# EAGLE schematic H-bro_gear (EAGLE 6.5.0)
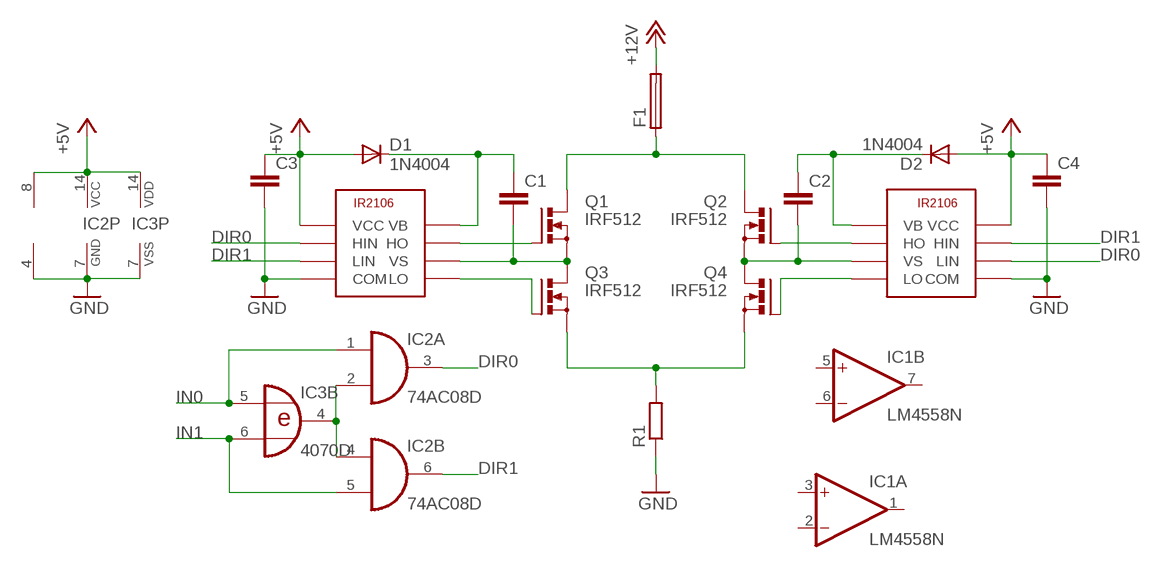
[diagram p0: schematic, sheet 1]

## Parts
C1  C-EU025-025X050  [C025-025X050]
C2  C-EU025-025X050  [C025-025X050]
C3  C-EU025-025X050  [C025-025X050]
C4  C-EU025-025X050  [C025-025X050]
D1  1N4004  [DO41-10]
D2  1N4004  [DO41-10]
F1  PICOFUSE  [PICOFUSE]
IC1  LM4558N  [DIL08]
IC2  74AC08D  [SO14]
IC3  4070D  [SO14]
Q1  IRF512  [TO220BV]
Q2  IRF512  [TO220BV]
Q3  IRF512  [TO220BV]
Q4  IRF512  [TO220BV]
R1  R-EU_0309/12  [0309/12]
U$1  IR2106  [IR2106]
U$2  IR2106  [IR2106]

## Nets
+5V: C3.1 C4.1 D1.A D2.A IC1.8(P:V+) IC2.14(P:VCC) IC3.14(P:VDD) U$1.VCC U$2.VCC
+12V: F1.2
DIR0: IC2.3(A:O) U$1.HIN U$2.LIN
DIR1: IC2.6(B:O) U$1.LIN U$2.HIN
GND: C3.2 C4.2 IC1.4(P:V-) IC2.7(P:GND) IC3.7(P:VSS) R1.1 U$1.COM U$2.COM
IN0: IC2.1(A:I0) IC3.5(B:I0)
IN1: IC2.5(B:I1) IC3.6(B:I1)
N$1: Q1.G U$1.HO
N$2: Q3.G U$1.LO
N$3: Q2.G U$2.HO
N$4: Q4.G U$2.LO
N$6: C1.2 Q1.S Q3.D U$1.VS
N$7: C2.2 Q2.S Q4.D U$2.VS
N$9: F1.1 Q1.D Q2.D
N$10: C1.1 D1.C U$1.VB
N$11: Q3.S Q4.S R1.2
N$13: C2.1 D2.C U$2.VB
N$15: IC2.2(A:I1) IC2.4(B:I0) IC3.4(B:O)
Unconnected: IC1.1(A:OUT) IC1.2(A:-IN) IC1.3(A:+IN) IC1.5(B:+IN) IC1.6(B:-IN) IC1.7(B:OUT) IC2.8(C:O) IC2.9(C:I0) IC2.10(C:I1) IC2.11(D:O) IC2.12(D:I0) IC2.13(D:I1) IC3.1(A:I0) IC3.2(A:I1) IC3.3(A:O) IC3.8(C:I0) IC3.9(C:I1) IC3.10(C:O) IC3.11(D:O) IC3.12(D:I0) IC3.13(D:I1)

## Library data of the parts
C1-C4 = resistor:C-EU: CAPACITOR, European symbol
D1 D2 = diode:1N4004: DIODE general purpose rectifier, 1 A
F1 = fuse:PICOFUSE: PICOFUSE 19275, Wickmann; OC_FARNELL: unknown; OC_NEWARK: unknown
IC1 = linear:*4558: OP AMP
IC2 = 74xx-eu:74*08: Quad 2-input AND gate
IC3 = 40xx:4070: Quad 2-input XOR
Q1-Q4 = transistor-power:IRF512: N-CHANNEL MOS FET
R1 = resistor:R-EU_: RESISTOR, European symbol
U$1 U$2 = IR2106:IR2106; DEVICE: IR2106